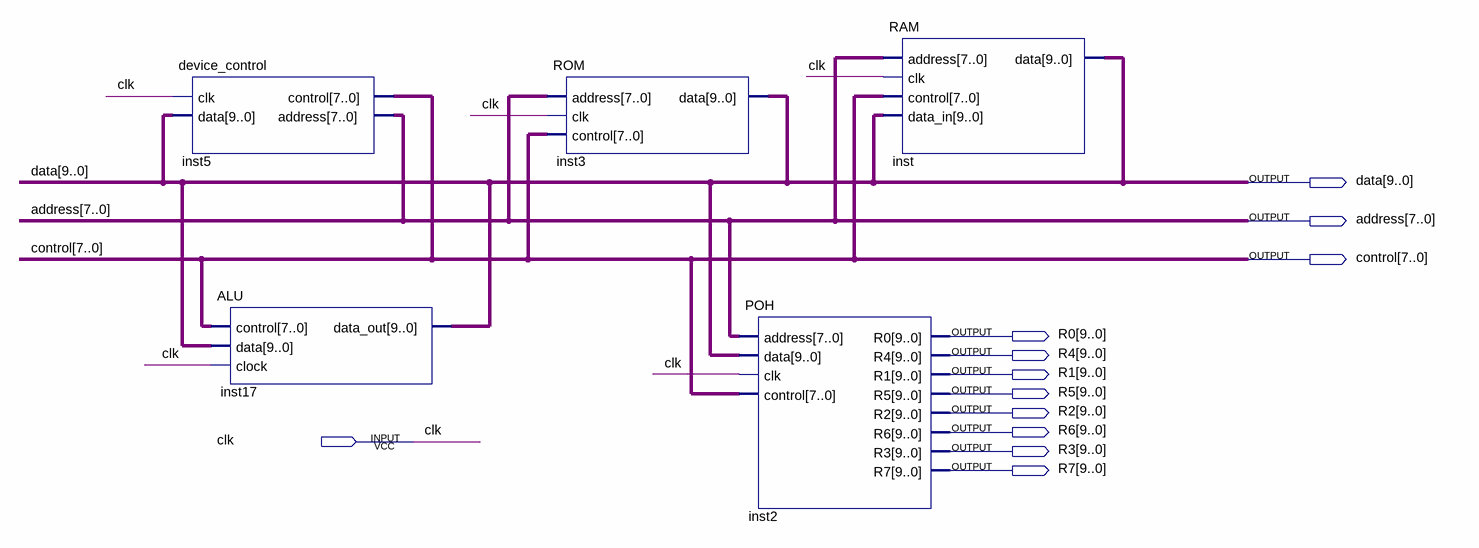
[diagram p0: schematic sheet]
// Quartus schematic main.bdf as structural Verilog: 5 symbols, 12 pins
module main (
  input  clk,
  output [9:0] data,
  output [7:0] address,
  output [7:0] control,
  output [9:0] R0,
  output [9:0] R4,
  output [9:0] R1,
  output [9:0] R5,
  output [9:0] R2,
  output [9:0] R6,
  output [9:0] R3,
  output [9:0] R7
);

  device_control inst5 (.clk(clk), .data(data), .control(control), .address(address));
  ALU inst17 (.control(control), .data(data), .clock(clk), .data_out(data));
  ROM inst3 (.address(address), .clk(clk), .control(control), .data(data));
  POH inst2 (
    .address(address), .data(data), .clk(clk), .control(control), .R0(R0), .R4(R4), .R1(R1), .R5(R5),
    .R2(R2), .R6(R6), .R3(R3), .R7(R7));
  RAM inst (.address(address), .clk(clk), .control(control), .data_in(data), .data(data));
endmodule
